# EAGLE design single_board_controller (EAGLE 9.3.0)
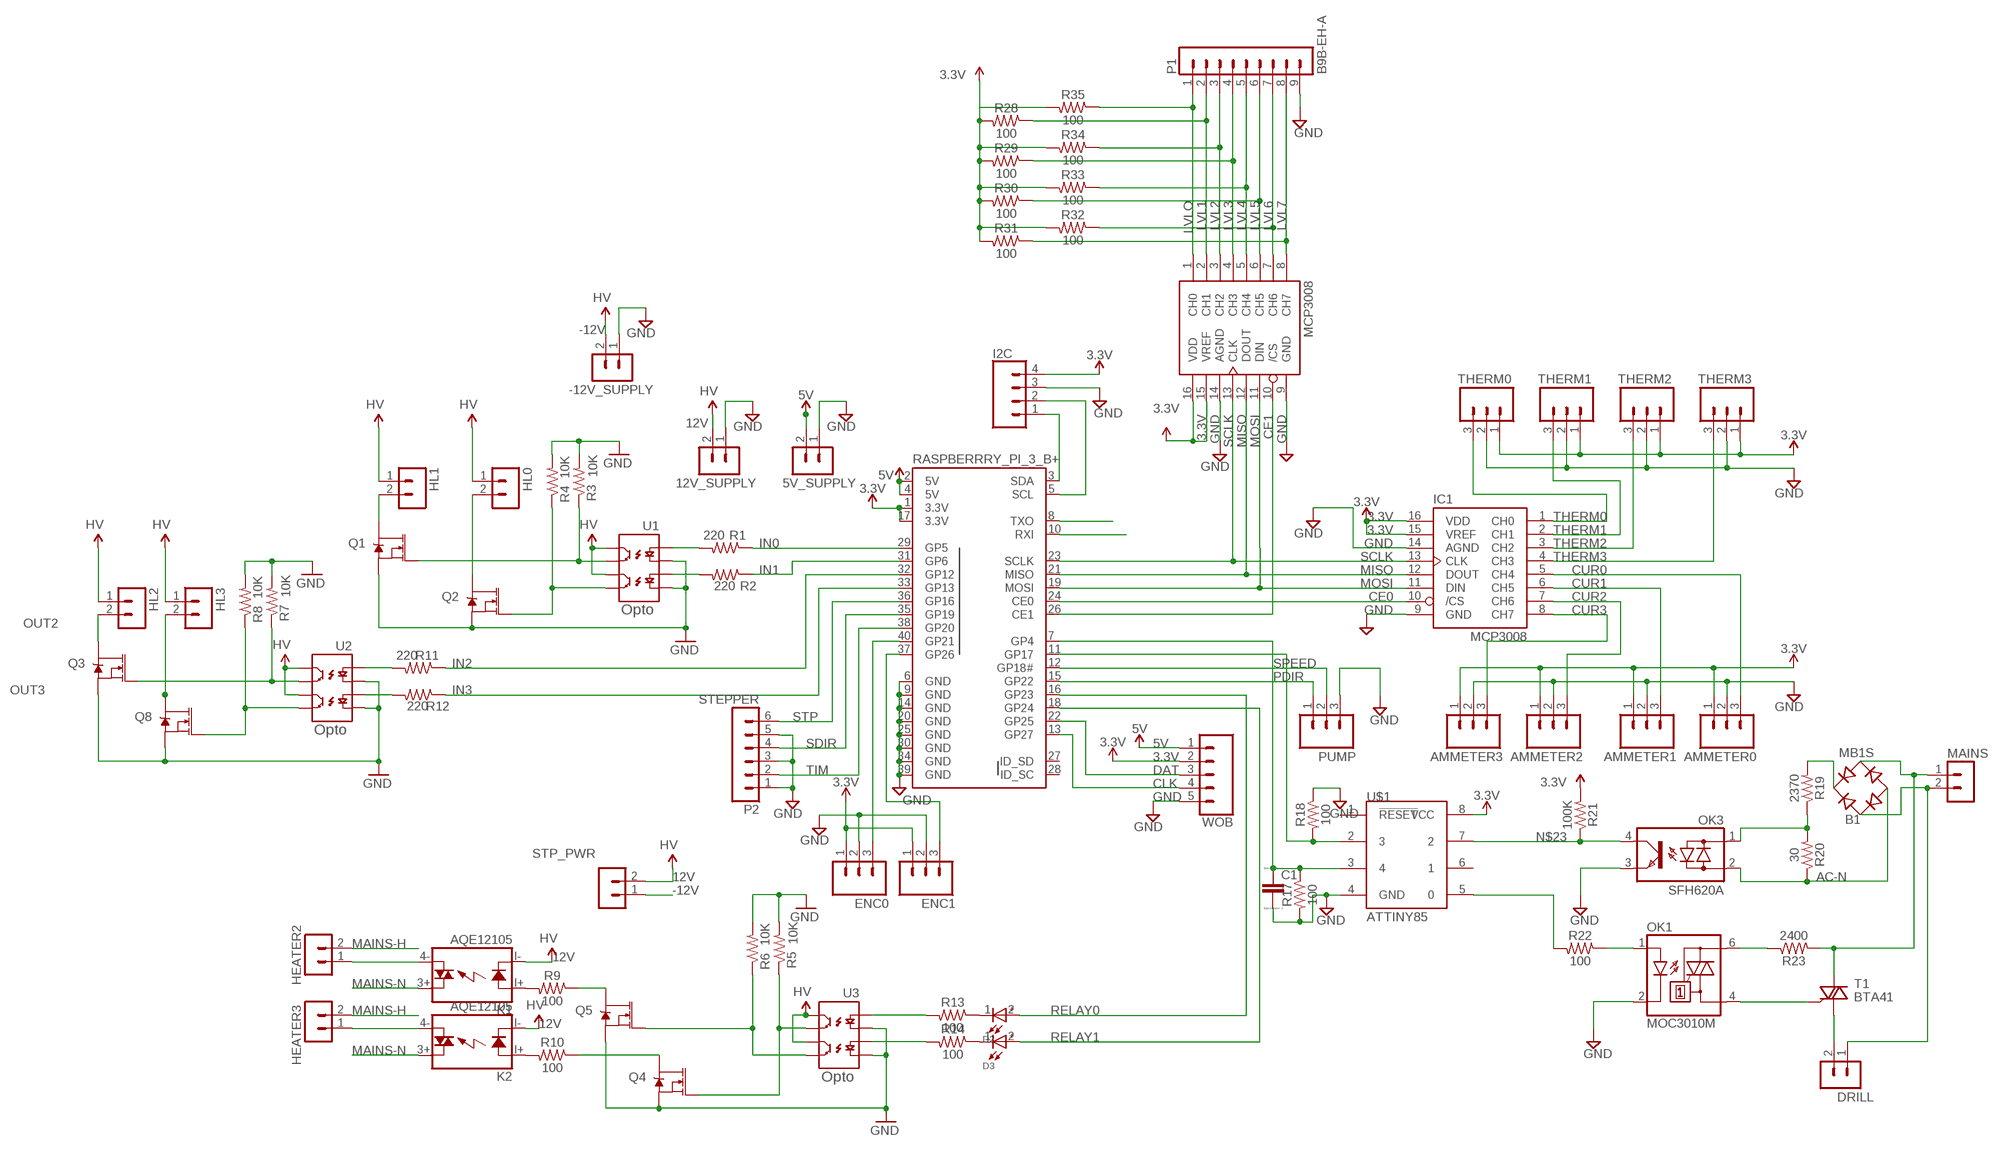
[diagram p0: schematic, sheet 1]

## Parts
5V_SUPPLY  B2P-VH  [B2P-VH]
12V_SUPPLY  B2P-VH  [B2P-VH]
-12V_SUPPLY  B2P-VH  [B2P-VH]
AMMETER0  CONN_03JST-PTH-VERT  [JST-3-PTH-VERT]
AMMETER1  CONN_03JST-PTH-VERT  [JST-3-PTH-VERT]
AMMETER2  CONN_03JST-PTH-VERT  [JST-3-PTH-VERT]
AMMETER3  CONN_03JST-PTH-VERT  [JST-3-PTH-VERT]
B1  MB1S  [SOIC-4]
C1  C  [C0805]
D2  WL-SMRW_1206_156120YS75000-Y  [WL-SMRW-1206-RECT]
D3  WL-SMRW_1206_156120YS75000-Y  [WL-SMRW-1206-RECT]
DRILL  B2P-VH  [B2P-VH]
ENC0  CONN_03JST-PTH-VERT  [JST-3-PTH-VERT]
ENC1  CONN_03JST-PTH-VERT  [JST-3-PTH-VERT]
HEATER2  B2P-VH  [B2P-VH]
HEATER3  B2P-VH  [B2P-VH]
HL0  B2P-VH  [B2P-VH]
HL1  B2P-VH  [B2P-VH]
HL2  B2P-VH  [B2P-VH]
HL3  B2P-VH  [B2P-VH]
I2C  CONN_04JST-PTH-VERT  [JST-4-PTH-VERT]
IC1  MCP3008  [DIL16]
IC2  MCP3008  [DIL16]
K1  AQE12105  [AQE]
K2  AQE12105  [AQE]
MAINS  B2P-VH  [B2P-VH]
OK1  MOC3010M  [DIL06]
OK3  SFH620A  [DIL04]
P1  B9B-EH-A  [B9B-EH-A]
P2  STEPPER  B6B-EH-A  [B6B-EH-A]
PUMP  CONN_03JST-PTH-VERT  [JST-3-PTH-VERT]
Q1  35A/25V/8.5mΩ  MOSFET-NCH-FDD8780  [DPAK]
Q2  35A/25V/8.5mΩ  MOSFET-NCH-FDD8780  [DPAK]
Q3  35A/25V/8.5mΩ  MOSFET-NCH-FDD8780  [DPAK]
Q4  35A/25V/8.5mΩ  MOSFET-NCH-FDD8780  [DPAK]
Q5  35A/25V/8.5mΩ  MOSFET-NCH-FDD8780  [DPAK]
Q8  35A/25V/8.5mΩ  MOSFET-NCH-FDD8780  [DPAK]
R1  220  220OHM-1/10W-1%(0603)  [0603-RES]
R2  220  220OHM-1/10W-1%(0603)  [0603-RES]
R3  10K  10KOHM1/10W1%(0603)0603  [0603-RES]
R4  10K  10KOHM1/10W1%(0603)0603  [0603-RES]
R5  10K  10KOHM1/10W1%(0603)0603  [0603-RES]
R6  10K  10KOHM1/10W1%(0603)0603  [0603-RES]
R7  10K  10KOHM1/10W1%(0603)0603  [0603-RES]
R8  10K  10KOHM1/10W1%(0603)0603  [0603-RES]
R9  100  0.3OHM-0805-1/8W-1%  [0805]
R10  100  0.3OHM-0805-1/8W-1%  [0805]
R11  220  220OHM-1/10W-1%(0603)  [0603-RES]
R12  220  220OHM-1/10W-1%(0603)  [0603-RES]
R13  100  0.3OHM-0805-1/8W-1%  [0805]
R14  100  0.3OHM-0805-1/8W-1%  [0805]
R17  100  0.3OHM-0805-1/8W-1%  [0805]
R18  100  0.3OHM-0805-1/8W-1%  [0805]
R19  2370  0.3OHM-0805-1/8W-1%  [0805]
R20  30  0.3OHM-0805-1/8W-1%  [0805]
R21  100K  0.3OHM-0805-1/8W-1%  [0805]
R22  100  0.3OHM-0805-1/8W-1%  [0805]
R23  2400  0.3OHM-0805-1/8W-1%  [0805]
R28  100  0.3OHM-0805-1/8W-1%  [0805]
R29  100  0.3OHM-0805-1/8W-1%  [0805]
R30  100  0.3OHM-0805-1/8W-1%  [0805]
R31  100  0.3OHM-0805-1/8W-1%  [0805]
R32  100  0.3OHM-0805-1/8W-1%  [0805]
R33  100  0.3OHM-0805-1/8W-1%  [0805]
R34  100  0.3OHM-0805-1/8W-1%  [0805]
R35  100  0.3OHM-0805-1/8W-1%  [0805]
RASPBERRRY_PI_3_B+  RASPBERRYPI-40-PIN-GPIO_PTH_NO_SHROUD  [2X20]
STP_PWR  B2P-VH  [B2P-VH]
T1  BTA41  BTA26-V  [TOP3S-1]
THERM0  CONN_03JST-PTH-VERT  [JST-3-PTH-VERT]
THERM1  CONN_03JST-PTH-VERT  [JST-3-PTH-VERT]
THERM2  CONN_03JST-PTH-VERT  [JST-3-PTH-VERT]
THERM3  CONN_03JST-PTH-VERT  [JST-3-PTH-VERT]
U1  OPTOISOLATOR-2SOIC8  [SO08-2]
U2  OPTOISOLATOR-2SOIC8  [SO08-2]
U3  OPTOISOLATOR-2SOIC8  [SO08-2]
U$1  ATTINY85  [8P3]
WOB  CONN_05JST-VERT  [JST-5-PTH-VERT]

## Nets
3.3V: AMMETER0.1 AMMETER1.1 AMMETER2.1 AMMETER3.1 ENC0.1 ENC1.1 I2C.4 IC1.15(VREF) IC1.16(VDD) IC2.15(VREF) IC2.16(VDD) R21.2 R28.2 R29.2 R30.2 R31.2 R32.2 R33.2 R34.2 R35.2 RASPBERRRY_PI_3_B+.1(3.3V) RASPBERRRY_PI_3_B+.17(3.3V) THERM0.1 THERM1.1 THERM2.1 THERM3.1 U$1.8(VCC) WOB.2
5V: 5V_SUPPLY.2 RASPBERRRY_PI_3_B+.2(5V) RASPBERRRY_PI_3_B+.4(5V) WOB.1
12V: 12V_SUPPLY.2 HL0.1 HL1.1 HL2.1 HL3.1 K1.I-(K) K2.I-(K) STP_PWR.2 U1.6(CL2) U1.8(CL1) U2.6(CL2) U2.8(CL1) U3.6(CL2) U3.8(CL1) ; supply symbol labelled HV
-12V: -12V_SUPPLY.2 STP_PWR.1 ; supply symbol labelled HV
AC-N: B1.- OK3.2(AC2) R20.1
CE0: IC1.10(/CS) RASPBERRRY_PI_3_B+.24(CE0)
CE1: IC2.10(/CS) RASPBERRRY_PI_3_B+.26(CE1)
CLK: RASPBERRRY_PI_3_B+.13(GP27) WOB.4
CONTROL: R18.2 RASPBERRRY_PI_3_B+.11(GP17) U$1.2
CUR0: AMMETER0.3 IC1.5(CH4)
CUR1: AMMETER1.3 IC1.6(CH5)
CUR2: AMMETER2.3 IC1.7(CH6)
CUR3: AMMETER3.3 IC1.8(CH7)
DAT: RASPBERRRY_PI_3_B+.22(GP25) WOB.3
GND: 5V_SUPPLY.1 12V_SUPPLY.1 -12V_SUPPLY.1 AMMETER0.2 AMMETER1.2 AMMETER2.2 AMMETER3.2 C1.2 ENC0.2 ENC1.2 I2C.3 IC1.9(GND) IC1.14(AGND) IC2.9(GND) IC2.14(AGND) OK1.2(C) OK3.3(E) P1.9 P2.1 P2.3 P2.5 PUMP.3 Q1.3(S) Q2.3(S) Q3.3(S) Q4.3(S) Q5.3(S) Q8.3(S) R3.2 R4.2 R5.2 R6.2 R7.2 R8.2 R17.2 R18.1 RASPBERRRY_PI_3_B+.6(GND) RASPBERRRY_PI_3_B+.9(GND) RASPBERRRY_PI_3_B+.14(GND) RASPBERRRY_PI_3_B+.20(GND) RASPBERRRY_PI_3_B+.25(GND) RASPBERRRY_PI_3_B+.30(GND) RASPBERRRY_PI_3_B+.34(GND) RASPBERRRY_PI_3_B+.39(GND) THERM0.2 THERM1.2 THERM2.2 THERM3.2 U1.2(C1) U1.4(C2) U2.2(C1) U2.4(C2) U3.2(C1) U3.4(C2) U$1.4(GND) WOB.5
IN0: R1.1 RASPBERRRY_PI_3_B+.29(GP5)
IN1: R2.1 RASPBERRRY_PI_3_B+.31(GP6)
IN2: R11.1 RASPBERRRY_PI_3_B+.32(GP12)
IN3: R12.1 RASPBERRRY_PI_3_B+.33(GP13)
LVL1: IC2.2(CH1) P1.2 R28.1
LVL2: IC2.3(CH2) P1.3 R34.1
LVL3: IC2.4(CH3) P1.4 R29.1
LVL4: IC2.5(CH4) P1.5 R33.1
LVL5: IC2.6(CH5) P1.6 R30.1
LVL6: IC2.7(CH6) P1.7 R32.1
LVL7: IC2.8(CH7) P1.8 R31.1
LVLO: IC2.1(CH0) P1.1 R35.1
MAINS-H: B1.~2(AC2) HEATER2.2 HEATER3.2 MAINS.1 R23.2 T1.A2
MAINS-N: B1.~1(AC1) DRILL.1 K1.3+(DS1) K2.3+(DS1) MAINS.2
MISO: IC1.12(DOUT) IC2.12(DOUT) RASPBERRRY_PI_3_B+.21(MISO)
MOSI: IC1.11(DIN) IC2.11(DIN) RASPBERRRY_PI_3_B+.19(MOSI)
N$1: R1.2 U1.1(A1)
N$2: R2.2 U1.3(A2)
N$3: R11.2 U2.1(A1)
N$4: R12.2 U2.3(A2)
N$5: ENC1.3 RASPBERRRY_PI_3_B+.37(GP26)
N$6: ENC0.3 RASPBERRRY_PI_3_B+.40(GP21)
N$7: OK3.1(AC1) R19.1 R20.2
N$8: OK1.1(A) R22.1
N$9: OK1.6(A2) R23.1
N$10: OK1.4(A1) T1.G
N$11: DRILL.2 T1.A1
N$12: HEATER2.1 K1.4-(DS2)
N$13: D2.1(-) R13.1
N$14: K2.I+(A) R10.2
N$15: D3.1(-) R14.1
N$16: K1.I+(A) R9.2
N$17: HEATER3.1 K2.4-(DS2)
N$22: R13.2 U3.1(A1)
N$23: OK3.4(C) R21.1 U$1.7
N$26: B1.+ R19.2
N$27: R22.2 U$1.5
N$28: I2C.2 RASPBERRRY_PI_3_B+.5(SCL)
N$29: C1.1 R17.1 RASPBERRRY_PI_3_B+.7(GP4) U$1.3
N$30: I2C.1 RASPBERRRY_PI_3_B+.3(SDA)
N$31: RASPBERRRY_PI_3_B+.10(RXI)
N$32: RASPBERRRY_PI_3_B+.8(TXO)
N$33: R14.2 U3.3(A2)
N$36: Q5.4(D) R9.1
N$37: Q4.4(D) R10.1
OUT0: HL1.2 Q1.4(D)
OUT1: HL0.2 Q2.4(D)
OUT1N: Q1.1(G) R3.1 U1.7(EM1)
OUT1N1: Q3.1(G) R7.1 U2.7(EM1)
OUT1N2: Q4.1(G) R5.1 U3.7(EM1)
OUT2: HL2.2 Q3.4(D)
OUT2N: Q2.1(G) R4.1 U1.5(EM2)
OUT2N1: Q8.1(G) R8.1 U2.5(EM2)
OUT2N2: Q5.1(G) R6.1 U3.5(EM2)
OUT3: HL3.2 Q8.4(D)
PDIR: PUMP.1 RASPBERRRY_PI_3_B+.15(GP22)
RELAY0: D2.2(+) RASPBERRRY_PI_3_B+.16(GP23)
RELAY1: D3.2(+) RASPBERRRY_PI_3_B+.18(GP24)
SCLK: IC1.13(CLK) IC2.13(CLK) RASPBERRRY_PI_3_B+.23(SCLK)
SDIR: P2.4 RASPBERRRY_PI_3_B+.35(GP19)
SPEED: PUMP.2 RASPBERRRY_PI_3_B+.12(GP18#)
STP: P2.6 RASPBERRRY_PI_3_B+.36(GP16)
THERM0: IC1.1(CH0) THERM0.3
THERM1: IC1.2(CH1) THERM1.3
THERM2: IC1.3(CH2) THERM2.3
THERM3: IC1.4(CH3) THERM3.3
TIM: P2.2 RASPBERRRY_PI_3_B+.38(GP20)
Unconnected: RASPBERRRY_PI_3_B+.27(ID_SD) RASPBERRRY_PI_3_B+.28(ID_SC) U$1.1(!RESET) U$1.6

## Notes on the sheet
- Opto
- Opto
- Opto

## Library data of the parts
5V_SUPPLY 12V_SUPPLY -12V_SUPPLY DRILL HEATER2 HEATER3 HL0 HL1-HL3 MAINS STP_PWR = con-jst-vh:B2P-VH: HEADER
AMMETER0 AMMETER1-AMMETER3 ENC0 ENC1 PUMP THERM0 THERM1-THERM3 = SparkFun-Connectors:CONN_03: Multi connection point. Often used as Generic Header-pin footprint for 0.1 inch spaced/style header connections On any of the 0.1 inch spaced packages, you can populate with these: Break Away Headers - Straight <https://www.sparkfun.com/products/116> (PRT-00116) Break Away Male Headers - Right Angle <https://www.sparkfun.com/products/553> (PRT-00553) Female Headers <https://www.sparkfun.com/products/115> (PRT-00115) Break Away Headers - Machine Pin <https://www.sparkfun.com/products/117> (PRT-00117) Break Away Female Headers - Swiss Machine Pin <https://www.sparkfun.com/products/743> (PRT-00743) Stackable Header - 3 Pin (Female, 0.1") <https://www.sparkfun.com/products/13875> (PRT-13875) For SCREWTERMINALS and SPRING TERMINALS visit here: Screw Terimnals on SparkFun.com <https://www.sparkfun.com/search/results?term=Screw+Terminals> (5mm/3.5mm/2.54mm spacing) This device is also useful as a general connection point to wire up your design to another part of your project. Our various solder wires solder well into these plated through hole pads. Hook-Up Wire - Assortment (Stranded, 22 AWG) <https://www.sparkfun.com/products/11375> (PRT-11375) Hook-Up Wire - Assortment (Solid Core, 22 AWG) <https://www.sparkfun.com/products/11367> (PRT-11367) View the entire wire category on our website here <https://www.sparkfun.com/categories/141> Special notes: Molex polarized connector foot print use with SKU : PRT-08232 with associated crimp pins and housings.; PROD_ID: CONN-13230
B1 = rectifier:MB*S: Bridge Rectifier Source: http://www.fairchildsemi.com/ds/MB/MB6S.pdf
C1 = eagle-ltspice:C: CAPACITOR, European symbol; SPICEMODEL: NONE; SPICEPREFIX: C
D2 D3 = Wurth_Elektronik_Optoelectronics_rev18a:WL-SMRW_1206: WL-SMRW SMD Mono-color Reverse mount Waterclear Characteristics Ideal for narrow space applications Narrow viewing angle Low power consumption Industry standard footprint Small package for exceptional brightness To emit light through a small cut-out hole in PCB Compatible with automatic placement machine Applications Front panels indicators LCD backlighting Backlighting for keypad, symbol and switch button Messaenger board Networking and telecommunications Mobile devices Instrumentation Fitness wearables Audio and video Medical and healthcare <http://katalog.we-online.de/media/images/v2/Family_WL-SMRW_neu.jpg> Details see: http://katalog.we-online.de/en/led/WL-SMRW?m <http://katalog.we-online.de/media/images/v2/Family_WL-SMRW_neu.jpg> Details see: http://katalog.we-online.de/en/led/WL-SMRW?m Updated 2015-04-10 2015 (C) Wurth Elektronik
I2C = SparkFun-Connectors:CONN_04: Multi connection point. Often used as Generic Header-pin footprint for 0.1 inch spaced/style header connections On any of the 0.1 inch spaced packages, you can populate with these: Break Away Headers - Straight <https://www.sparkfun.com/products/116> (PRT-00116) Break Away Male Headers - Right Angle <https://www.sparkfun.com/products/553> (PRT-00553) Female Headers <https://www.sparkfun.com/products/115> (PRT-00115) Break Away Headers - Machine Pin <https://www.sparkfun.com/products/117> (PRT-00117) Break Away Female Headers - Swiss Machine Pin <https://www.sparkfun.com/products/743> (PRT-00743) For SCREWTERMINALS and SPRING TERMINALS visit here: Screw Terimnals on SparkFun.com <https://www.sparkfun.com/search/results?term=Screw+Terminals> (5mm/3.5mm/2.54mm spacing) This device is also useful as a general connection point to wire up your design to another part of your project. Our various solder wires solder well into these plated through hole pads. Hook-Up Wire - Assortment (Stranded, 22 AWG) <https://www.sparkfun.com/products/11375> (PRT-11375) Hook-Up Wire - Assortment (Solid Core, 22 AWG) <https://www.sparkfun.com/products/11367> (PRT-11367) View the entire wire category on our website here <https://www.sparkfun.com/categories/141> Special notes: Molex polarized connector foot print use with SKU : PRT-08231 with associated crimp pins and housings. 1MM SMD Version SKU: PRT-10208; PROD_ID: CONN-13251
IC1 IC2 = adafruit:MCP3008
K1 K2 = G6DN_relay:AQE*: SOLID STATE RELAY NAiS source: http://www.mew-europe.com/.. en_ds_61610_0000.pdf
OK1 = optocoupler:MOC30*M: RANDOM-PHASE OPTOISOLATORS TRIAC DRIVER OUTPUT Source: http://www.fairchildsemi.com MOC3020-M.pdf; MF: FAIRCHILD SEMICONDUCTOR; MPN: MOC3010-M; OC_FARNELL: 1505423; OC_NEWARK: 72K8892
OK3 = optocoupler:SFH620: Optocoupler, Phototransistor Output, AC Input Source: http://www.vishay.com/docs/83675/sfh620.pdf; MPN: SFH620A-2; OC_FARNELL: 1469594; OC_NEWARK: 97K9546
P1 = con-jst-eh:B9B-EH-A: HEADER
P2 = con-jst-eh:B6B-EH-A: HEADER
Q1-Q5 Q8 = SparkFun-DiscreteSemi:MOSFET-NCH: N-channel MOSFETs Voltage controlled devices that allow control of high current outputs. SparkFun Products: SparkFun OpenScale <https://www.sparkfun.com/products/13261> SparkFun Digital Sandbox <https://www.sparkfun.com/products/12651> SparkFun Monster Moto Shield <https://www.sparkfun.com/products/10182> SparkFun MOSFET Power Controller <https://www.sparkfun.com/products/11214>; PROD_ID: TRANS-09984
R1 R2 R11 R12 = SparkFun-Resistors:220OHM-1/10W-1%(0603): RES-07861; PROD_ID: RES-07861
R3-R8 = SparkFun-Resistors:10KOHM1/10W1%(0603): RES-00824; PROD_ID: RES-00824
R9 R10 R13 R14 R17-R23 R28-R35 = SparkFun-Resistors:0.3OHM: 0.3Ω resistor A resistor is a passive two-terminal electrical component that implements electrical resistance as a circuit element. Resistors act to reduce current flow, and, at the same time, act to lower voltage levels within circuits. - Wikipedia; PROD_ID: RES-11622; VALUE: 0.3
RASPBERRRY_PI_3_B+ = SparkFun-Connectors:RASPBERRYPI-40-PIN-GPIO: Raspberry Pi GPIO Header 2x20 pin connector, as found on B, B+, A+ models. Both shrouded PTH and SMT versions available. SparkFun Products: GPIO Shrouded Header <https://www.sparkfun.com/products/13054>- PTH SparkFun Pi Wedge (Preassembled) <https://www.sparkfun.com/products/13717>
T1 = triac:BTA26: 25A TRIAC Source: http://www.st.com/stonline/products/literature/ds/7470.pdf
U1-U3 = SparkFun-DiscreteSemi:OPTOISOLATOR-2: Description: Dual gate opto isolator. Vishay part : ILD213T; PROD_ID: IC-09076
U$1 = attiny85:ATTINY85
WOB = SparkFun-Connectors:CONN_05: Multi connection point. Often used as Generic Header-pin footprint for 0.1 inch spaced/style header connections On any of the 0.1 inch spaced packages, you can populate with these: Break Away Headers - Straight <https://www.sparkfun.com/products/116> (PRT-00116) Break Away Male Headers - Right Angle <https://www.sparkfun.com/products/553> (PRT-00553) Female Headers <https://www.sparkfun.com/products/115> (PRT-00115) Break Away Headers - Machine Pin <https://www.sparkfun.com/products/117> (PRT-00117) Break Away Female Headers - Swiss Machine Pin <https://www.sparkfun.com/products/743> (PRT-00743) For SCREWTERMINALS and SPRING TERMINALS visit here: Screw Terimnals on SparkFun.com <https://www.sparkfun.com/search/results?term=Screw+Terminals> (5mm/3.5mm/2.54mm spacing) This device is also useful as a general connection point to wire up your design to another part of your project. Our various solder wires solder well into these plated through hole pads. Hook-Up Wire - Assortment (Stranded, 22 AWG) <https://www.sparkfun.com/products/11375> (PRT-11375) Hook-Up Wire - Assortment (Solid Core, 22 AWG) <https://www.sparkfun.com/products/11367> (PRT-11367) View the entire wire category on our website here <https://www.sparkfun.com/categories/141> Special notes: Molex polarized connector foot print use with SKU : PRT-08231 with associated crimp pins and housings. 1MM SMD Version SKU: PRT-10208

## Board
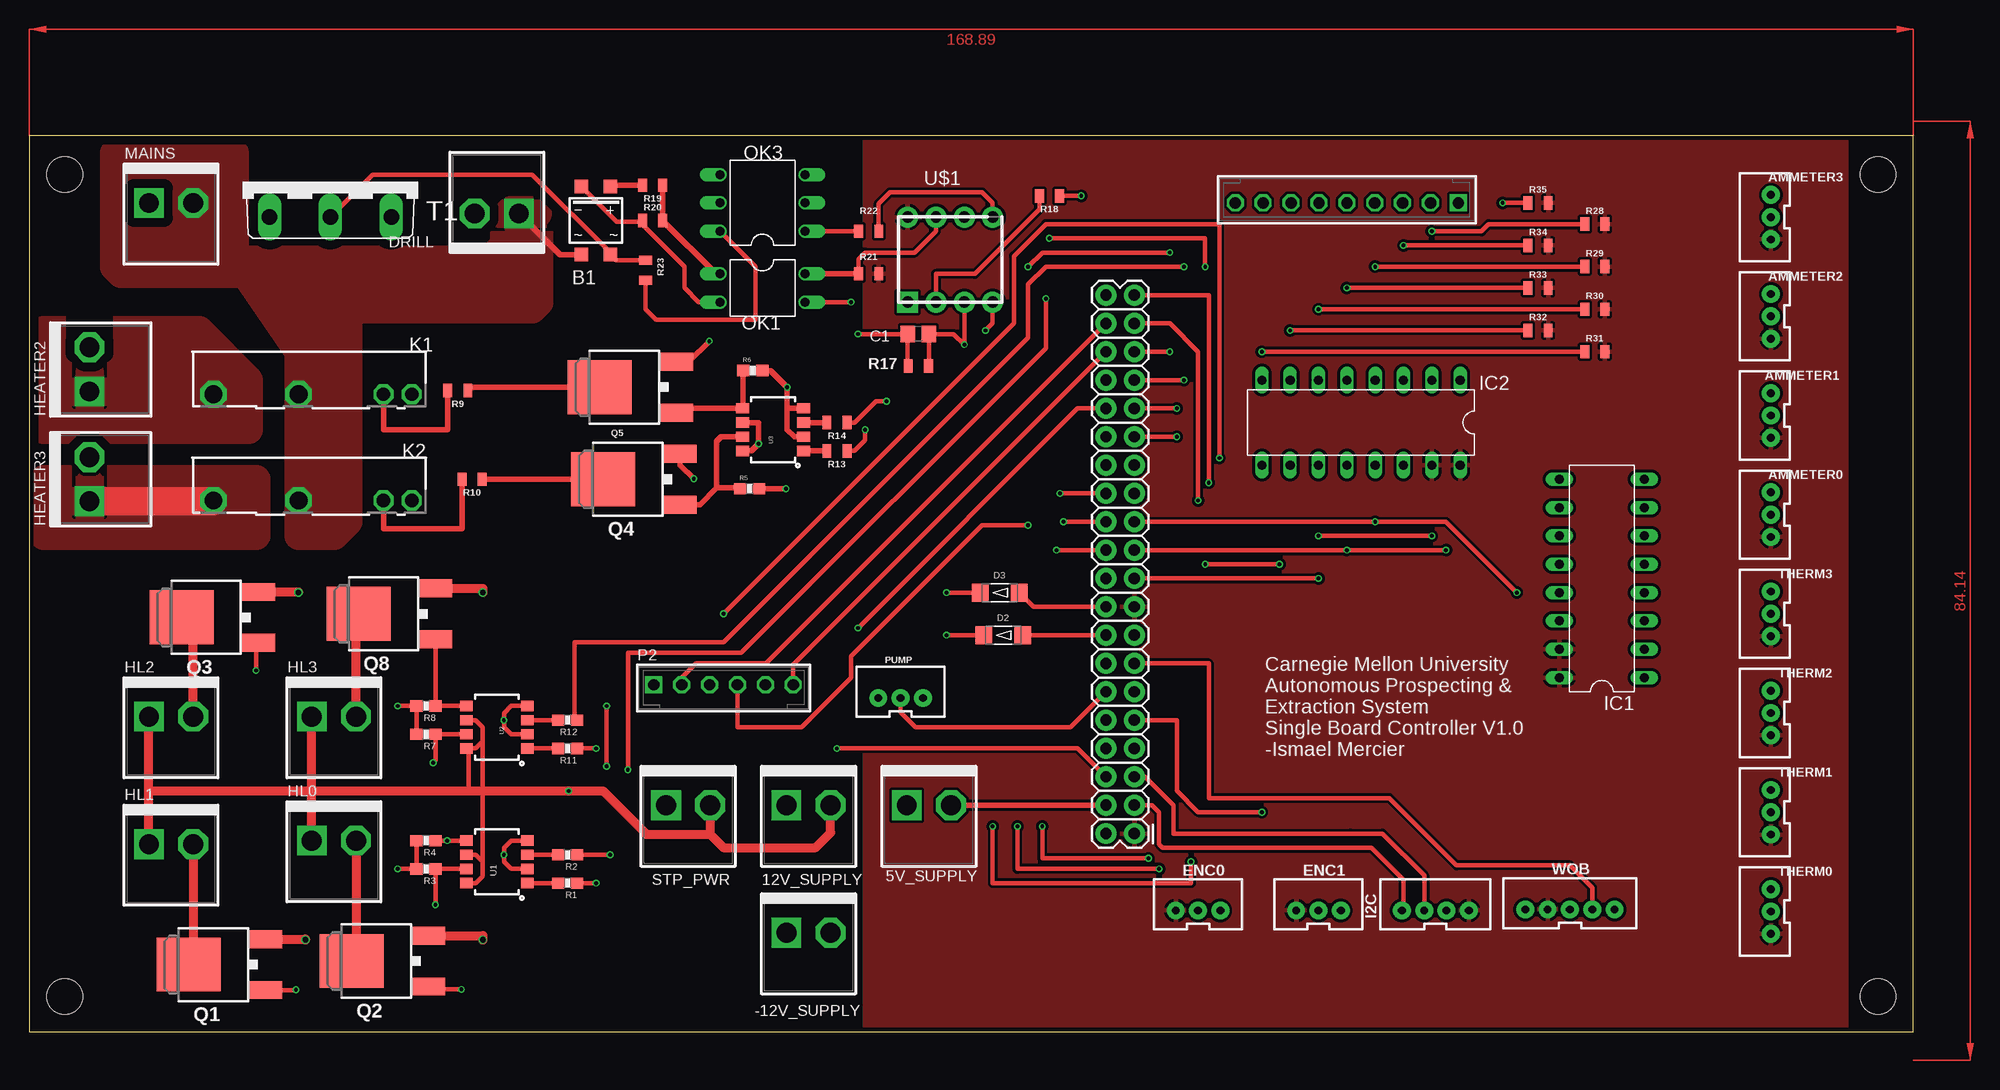
[diagram p1: board, top side]
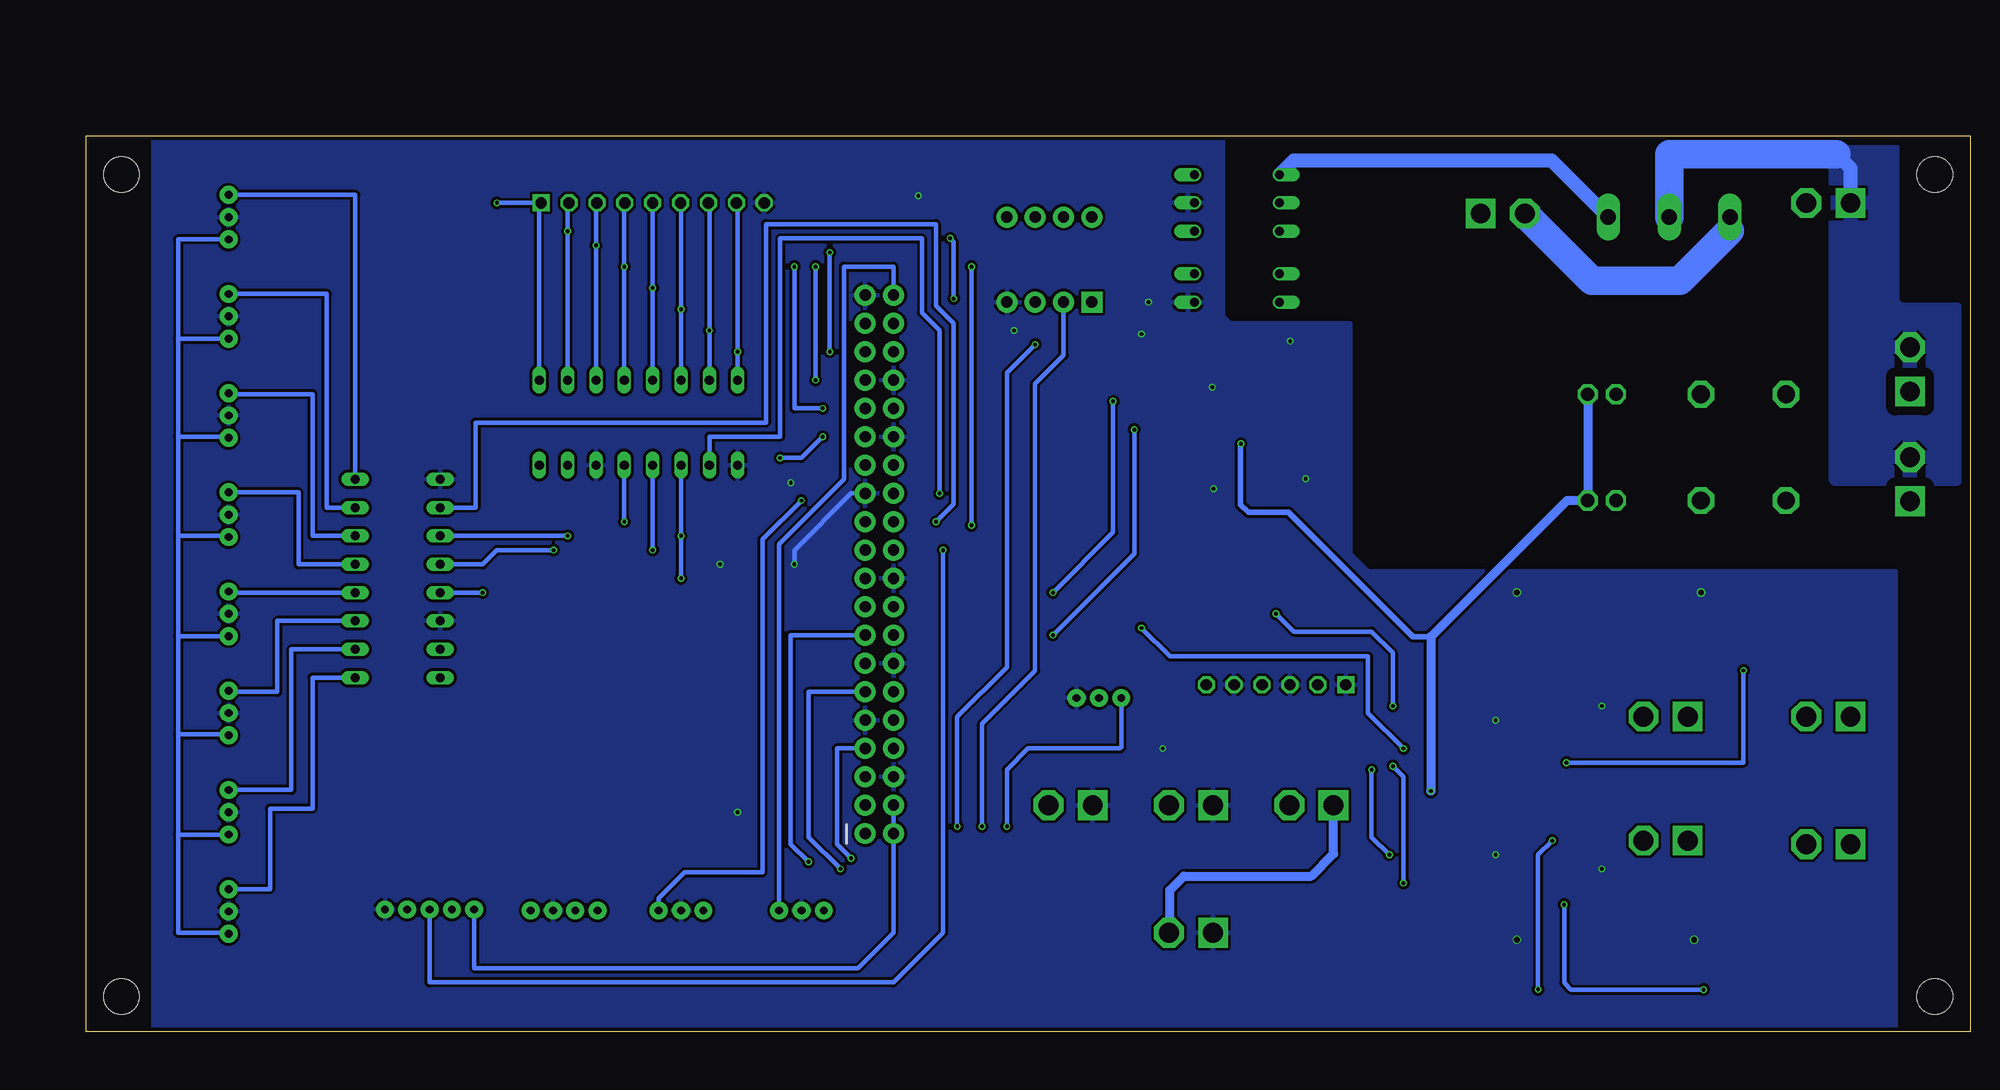
[diagram p2: board, bottom side, seen from below]

Size 168.89 x 80.31 mm. Coordinates in mm from the lower left corner, seen from the top.
Outline: 0,0 168.89,0 168.89,80.31 0,80.31 0,0
Copper layers (1*16): Top 0.035559375mm / dielectric 1.6mm / Bottom 0.035559375mm
Design rules "oshpark-2layer": minimum track width 6mil, minimum drill 10mil, track to track 6mil, track to pad 6mil, pad to pad 6mil, via to via 6mil, smd to smd 6mil, copper to edge 15mil, drill to drill 6mil, minimum pad ring 5mil, minimum via ring 5mil, stop-mask expansion 2.5mil, vias tented up to drill 0mil, thermal gap 10mil
Holes 3.17 mm at 165.74,76.83 165.74,3.18 3.17,76.83 3.17,3.18

### Footprints (pad centres in the part's own frame; a part is rotated, then mirrored left to right if it is on the bottom)
B2P-VH = drill 1.778 square: 1 -1.98,0 | drill 1.778 octagon: 2 1.98,0
JST-3-PTH-VERT = drill 0.7 pad 1.6: 1 -2,-0.55; 2 0,-0.55; 3 2,-0.55
SOIC-4 = smd 1.2 x 1.2: + 1.3,3.05; - -1.3,3.05; ~1 -1.3,-3.05; ~2 1.3,-3.05
C0805 = smd 1.3 x 1.5: 1 -0.95,0; 2 0.95,0
WL-SMRW-1206-RECT = smd 1.5 x 1.6: 1 -1.75,0; 2 1.75,0
JST-4-PTH-VERT = drill 0.7 pad 1.6: 1 -3,-0.55; 2 -1,-0.55; 3 1,-0.55; 4 3,-0.55
DIL16 = drill 0.813 long: 1 -8.89,-3.81; 2 -6.35,-3.81; 3 -3.81,-3.81; 4 -1.27,-3.81; 5 1.27,-3.81; 6 3.81,-3.81; 7 6.35,-3.81; 8 8.89,-3.81; 9 8.89,3.81; 10 6.35,3.81; 11 3.81,3.81; 12 1.27,3.81; 13 -1.27,3.81; 14 -3.81,3.81; 15 -6.35,3.81; 16 -8.89,3.81
AQE = drill 1.6 octagon: 3+ -7.62,0; 4- 0,0 | drill 1.2 octagon: I+ -15.24,0; I- -17.78,0
DIL06 = drill 0.813 offset: 1 -2.54,-3.81; 2 0,-3.81; 3 2.54,-3.81; 4 2.54,3.81; 5 0,3.81; 6 -2.54,3.81
DIL04 = drill 0.813 offset: 1 -1.27,-3.81; 2 1.27,-3.81; 3 1.27,3.81; 4 -1.27,3.81
B9B-EH-A = drill 1.016 square: 1 -10,0 | drill 1.016 octagon: 2 -7.5,0; 3 -5,0; 4 -2.5,0; 5 0,0; 6 2.5,0; 7 5,0; 8 7.5,0; 9 10,0
B6B-EH-A = drill 1.016 square: 1 -6.25,0 | drill 1.016 octagon: 2 -3.75,0; 3 -1.25,0; 4 1.25,0; 5 3.75,0; 6 6.25,0
DPAK = smd 1.6 x 3: 1 -2.28,-5.31; 3 2.28,-5.31 | smd 4.826 x 5.715: 4 0,1.588
0603-RES = smd 1.1 x 1: 1 -0.85,0; 2 0.85,0
0805 = smd 0.8 x 1.2: 1 -0.9,0; 2 0.9,0
2X20 = drill 1.016 pad 1.88: 1 0,0; 2 0,2.54; 3 2.54,0; 4 2.54,2.54; 5 5.08,0; 6 5.08,2.54; 7 7.62,0; 8 7.62,2.54; 9 10.16,0; 10 10.16,2.54; 11 12.7,0; 12 12.7,2.54; 13 15.24,0; 14 15.24,2.54; 15 17.78,0; 16 17.78,2.54; 17 20.32,0; 18 20.32,2.54; 19 22.86,0; 20 22.86,2.54; 21 25.4,0; 22 25.4,2.54; 23 27.94,0; 24 27.94,2.54; 25 30.48,0; 26 30.48,2.54; 27 33.02,0; 28 33.02,2.54; 29 35.56,0; 30 35.56,2.54; 31 38.1,0; 32 38.1,2.54; 33 40.64,0; 34 40.64,2.54; 35 43.18,0; 36 43.18,2.54; 37 45.72,0; 38 45.72,2.54; 39 48.26,0; 40 48.26,2.54
TOP3S-1 = drill 1.397 long: A1 -5.461,-3.175; A2 0,-3.175; G 5.461,-3.175
SO08-2 = smd 0.914 x 1.143: 1 -1.905,-2.731; 2 -0.635,-2.731; 3 0.635,-2.731; 4 1.905,-2.731; 5 1.905,2.731; 6 0.635,2.731; 7 -0.635,2.731; 8 -1.905,2.731
8P3 = drill 1.016 pad 1.88 square: 1 -3.81,3.81 | drill 1.016 pad 1.88: 2 -3.81,1.27; 3 -3.81,-1.27; 4 -3.81,-3.81; 5 3.81,-3.81; 6 3.81,-1.27; 7 3.81,1.27; 8 3.81,3.81
JST-5-PTH-VERT = drill 0.7 pad 1.6: 1 -4,0.18; 2 -2,0.18; 3 0,0.18; 4 2,0.18; 5 4,0.18

### Placement (x,y rotation side)
5V_SUPPLY  80.64,20.32 0 top
12V_SUPPLY  69.85,20.32 0 top
-12V_SUPPLY  69.85,8.89 0 top
AMMETER0  155.58,46.36 90 top
AMMETER1  155.58,55.25 90 top
AMMETER2  155.58,64.13 90 top
AMMETER3  155.58,73.02 90 top
B1  50.8,72.71 0 top
C1  79.69,62.55 180 top
D2  87.31,35.56 0 top
D3  86.99,39.37 0 top
DRILL  41.91,73.34 180 top
ENC0  104.77,11.43 0 top
ENC1  115.57,11.43 0 top
HEATER2  5.4,59.37 90 top
HEATER3  5.4,49.53 90 top
HL0  27.3,17.14 0 top
HL1  12.7,16.83 0 top
HL2  12.7,28.26 0 top
HL3  27.3,28.26 0 top
I2C  126.05,11.43 0 top
IC1  140.97,40.64 90 top
IC2  119.38,54.61 180 top
K1  16.51,57.15 180 top
K2  16.51,47.62 180 top
MAINS  12.7,74.3 0 top
OK1  65.72,74.3 90 top
OK3  65.72,66.67 270 top
P1  118.11,74.3 180 top
P2  62.23,31.11 0 top
PUMP  78.11,30.48 0 top
Q1  15.88,6.03 90 top
Q2  30.48,6.35 90 top
Q3  15.24,37.15 90 top
Q4  53.02,49.53 90 top
Q5  52.7,57.78 90 top
Q8  31.12,37.47 90 top
R1  48.26,13.34 180 top
R2  48.26,15.88 180 top
R3  35.56,14.61 180 top
R4  35.56,17.14 180 top
R5  64.56,48.69 0 top
R6  64.86,59.27 0 top
R7  35.56,26.67 180 top
R8  35.56,29.21 180 top
R9  38.42,57.47 180 top
R10  39.69,49.53 180 top
R11  48.26,25.4 180 top
R12  48.26,27.94 180 top
R13  72.39,52.07 180 top
R14  72.39,54.61 180 top
R17  79.69,59.69 180 top
R18  91.44,74.93 180 top
R19  55.88,75.88 180 top
R20  55.88,72.71 0 top
R21  75.25,67.94 0 top
R22  75.25,71.75 0 top
R23  55.24,68.26 90 top
R28  140.34,72.39 0 top
R29  140.34,68.58 0 top
R30  140.34,64.77 0 top
R31  140.34,60.96 0 top
R32  135.26,62.86 0 top
R33  135.26,66.67 0 top
R34  135.26,70.48 0 top
R35  135.26,74.3 0 top
RASPBERRRY_PI_3_B+  99.06,17.78 90 top
STP_PWR  59.05,20.32 0 top
T1  26.99,76.2 0 top
THERM0  155.58,10.8 90 top
THERM1  155.58,19.68 90 top
THERM2  155.58,28.57 90 top
THERM3  155.58,37.47 90 top
U1  41.91,15.24 90 top
U2  41.91,27.31 90 top
U3  66.67,53.97 90 top
U$1  82.55,69.22 90 top
WOB  138.11,10.8 0 top

### Tracks (layer width: path | path; a pad name or v marks a point on that pad's centre or on a via)
3.3V
  Bottom 0.406: AMMETER3.1 160.66,71.02 160.66,62.13 | 160.66,62.13 AMMETER2.1 | 160.66,62.13 160.66,53.34 | AMMETER1.1 156.12,53.34 160.66,53.34 | 160.66,53.34 160.66,44.45 | 160.66,44.45 156.12,44.45 AMMETER0.1 | 160.66,35.47 THERM3.1 | 160.66,44.45 160.66,35.47 | 160.66,35.47 160.66,26.67 | 160.66,26.67 156.12,26.67 THERM2.1 | 160.66,17.68 THERM1.1 | 160.66,26.67 160.66,17.68 | 160.66,17.68 160.66,8.89 156.12,8.89 THERM0.1
  pour Top (isolate 0.254): 74.93,84.45 74.93,-0.95 73.02,-2.86 162.88,-2.86 162.88,84.45
5V
  Top 0.508: 5V_SUPPLY.2 RASPBERRRY_PI_3_B+.4
  Bottom 0.406: WOB.1 134.11,5.71 99.69,5.71 96.52,8.89 RASPBERRRY_PI_3_B+.2 RASPBERRRY_PI_3_B+.4
12V  (via drill 0.35)
  Top 0.406: 39.37,21.59 39.37,25.21 U2.8 40,25.4 40.64,26.04 | U1.8 40,13.34 40.64,13.97 40.64,15.24 | 40.64,15.24 40,15.88 U1.6 | 40.64,15.24 40.64,21.59 40.64,26.04 | U2.6 40,27.94 40.64,27.31 40.64,26.04
  Top 0.508: U3.8 64.72,52.07 v65.37,52.71 65.37,54.58 65.34,54.61 U3.6
  Top 0.813: STP_PWR.2 61.03,17.71 | 61.03,17.71 62.23,16.51 70.48,16.51 71.83,17.86 12V_SUPPLY.2 | HL1.1 10.72,21.59 | 10.72,21.59 HL2.1 | HL0.1 25.32,21.59 | 25.32,21.59 HL3.1 | 10.72,21.59 25.32,21.59 | 25.32,21.59 39.37,21.59 40.64,21.59 v48.34,21.59 51.43,21.59 55.32,17.71 61.03,17.71
  Bottom 0.508: 48.35,35.42 49.97,35.42 61.12,46.57 64.71,46.57 65.41,47.27 65.41,52.68 v65.37,52.71
  Bottom 0.813: K1.I- K2.I- 36.14,47.62 48.35,35.42 48.35,21.58 48.35,21.59 v48.34,21.59
-12V
  Bottom 0.813: -12V_SUPPLY.2 71.75,8.96 71.75,12.7 70.48,13.97 59.05,13.97 57.07,15.95 STP_PWR.1
AC-N
  Top 0.406: R20.1 54.98,72.34 58.74,68.58 58.74,66.67 60.01,65.41 OK3.2 | B1.- 52.63,72.63 54.9,72.63
  Top 0.508: 54.9,72.63 R20.1
CE0  (via drill 0.35)
  Top 0.406: RASPBERRRY_PI_3_B+.24 v92.71,45.72
  Bottom 0.406: IC1.10 133.99,46.99 133.99,54.61 107.95,54.61 107.95,72.39 92.71,72.39 92.71,65.09 91.12,63.5 91.12,47.31 v92.71,45.72
CE1  (via drill 0.35)
  Top 0.406: RASPBERRRY_PI_3_B+.26 v92.39,48.26
  Bottom 0.406: IC2.10 113.03,53.34 106.68,53.34 106.68,71.12 93.98,71.12 93.98,64.45 92.39,62.86 v92.39,48.26
CLK
  Top 0.406: WOB.4 140.11,12.92 138.11,14.92 127.95,14.92 121.92,20.96 105.73,20.96 105.73,33.02 RASPBERRRY_PI_3_B+.13
CONTROL  (via drill 0.35)
  Top 0.406: v101.28,14.61 88.58,14.61 v88.58,18.42 | R18.2 90.54,73.71 84.77,67.94 81.28,67.94 U$1.2
  Bottom 0.406: RASPBERRRY_PI_3_B+.11 104.14,30.48 104.14,17.46 v101.28,14.61 | v88.58,18.42 88.58,27.62 83.82,32.39 83.82,58.1 81.28,60.64 U$1.2
CUR0
  Bottom 0.406: IC1.5 149.86,41.91 149.86,48.36 AMMETER0.3
CUR1
  Bottom 0.406: IC1.6 148.59,44.45 148.59,57.15 156.12,57.15 AMMETER1.3
CUR2
  Bottom 0.406: IC1.7 147.32,46.99 147.32,66.13 AMMETER2.3
CUR3
  Bottom 0.406: IC1.8 144.78,75.02 AMMETER3.3
DAT  (via drill 0.35)
  Top 0.406: RASPBERRRY_PI_3_B+.22 v92.08,43.18
  Bottom 0.406: v92.08,43.18 92.08,8.89 96.52,4.45 138.11,4.45 WOB.3
GND  (via drill 0.35, 0.5)
  Top 0.406: 44.45,26.67 U2.2 43.18,26.67 42.54,27.31 v42.54,27.94 42.54,28.57 43.18,29.21 U2.4 | RASPBERRRY_PI_3_B+.6 93.98,25.4 v72.39,25.4 | RASPBERRRY_PI_3_B+.39 105.73,66.04 v105.73,49.21 | OK3.3 v73.66,65.41 | R17.2 78.74,59.74 C1.2 v74.3,62.55 | U$1.4 86.36,63.5 v85.72,62.86 | v105.41,41.91 v112.08,41.91 | v94.3,74.93 R18.1 | v33.02,29.21 R8.2 R7.2 | v33.02,14.61 R3.2 R4.2 | U1.2 43.18,14.61 42.54,15.24 v42.54,15.88 42.54,16.51 43.18,17.14 U1.4 | RASPBERRRY_PI_3_B+.9 102.87,27.94 102.87,21.59 104.77,19.68 v110.49,19.68
  Top 0.508: Q5.3 59.11,60.06 v60.96,61.91 | v59.57,49.57 58.33,50.81 Q4.3 | 67.94,55.88 U3.4 | U3.2 68.58,53.34 67.94,53.97 67.94,55.88 | 67.94,55.88 v67.94,57.78 66.46,59.27 R6.2 | R5.2 v67.8,48.69 v67.82,48.67
  Top 0.813: Q3.3 24.13,39.43 v24.13,39.37 | Q8.3 40.64,39.75 v40.64,39.37 | Q1.3 24.77,8.31 v24.77,8.26 | Q2.3 40.64,8.63 v40.64,8.26
  Bottom 0.406: RASPBERRRY_PI_3_B+.25 100.33,48.26 105.41,43.18 v105.41,41.91
  pour Bottom (isolate 0.254): 162.88,-2.22 162.88,84.77 70.17,84.77 66.99,81.6 66.99,64.13 66.36,63.5 55.56,63.5 55.56,42.86 53.97,41.28 6.67,41.28 6.67,-2.22
IN0  (via drill 0.35)
  Top 0.406: RASPBERRRY_PI_3_B+.29 v102.87,53.34 | v106.68,51.44 106.68,72.39 91.12,72.39 88.27,69.53 88.27,63.5 v62.23,37.47 | v51.75,29.21 v51.75,23.81 | v50.8,13.34 R1.1
  Bottom 0.406: v102.87,53.34 104.77,51.44 v106.68,51.44 | v62.23,37.47 60.64,35.88 53.66,35.88 51.75,33.97 v51.75,29.21 | v51.75,23.81 50.8,22.86 v50.8,13.34
IN1  (via drill 0.35)
  Top 0.406: RASPBERRRY_PI_3_B+.31 v102.87,55.88 | v105.41,68.58 105.41,71.12 v91.44,71.12 | v91.12,65.72 91.12,61.28 63.82,33.97 53.66,33.97 v53.66,23.5 | v52.07,15.88 R2.1
  Bottom 0.406: v102.87,55.88 105.41,55.88 v105.41,68.58 | v91.44,71.12 91.12,70.8 v91.12,65.72 | v53.66,23.5 53.66,17.46 v52.07,15.88
IN2  (via drill 0.35)
  Top 0.406: RASPBERRRY_PI_3_B+.32 93.98,55.88 v74.3,36.2 | v50.8,25.4 R11.1
  Bottom 0.406: v74.3,36.2 71.75,33.66 53.97,33.66 53.97,28.57 v50.8,25.4
IN3  (via drill 0.35)
  Top 0.406: RASPBERRRY_PI_3_B+.33 v103.5,58.42 | v103.5,68.58 91.12,68.58 89.53,66.99 89.53,62.23 62.23,34.92 48.89,34.92 48.89,28.16 R12.1
  Bottom 0.406: v103.5,68.58 v103.5,58.42
LVL1  (via drill 0.35)
  Top 0.406: v125.73,71.75 130.18,71.75 130.81,72.39 R28.1
  Bottom 0.406: IC2.2 v125.73,71.75 125.73,74.17 P1.2
LVL2  (via drill 0.35)
  Top 0.406: R34.1 v123.19,70.48
  Bottom 0.406: IC2.3 v123.19,70.48 123.19,74.22 P1.3
LVL3  (via drill 0.35)
  Top 0.406: v120.65,68.58 R29.1
  Bottom 0.406: IC2.4 v120.65,68.58 120.65,74.25 P1.4
LVL4  (via drill 0.35)
  Top 0.406: R33.1 v118.11,66.67
  Bottom 0.406: IC2.5 v118.11,66.67 P1.5
LVL5  (via drill 0.35)
  Top 0.406: v115.57,64.77 R30.1
  Bottom 0.406: IC2.6 v115.57,64.77 115.57,74.25 P1.6
LVL6  (via drill 0.35)
  Top 0.406: R32.1 v113.03,62.86
  Bottom 0.406: IC2.7 v113.03,62.86 113.03,74.22 P1.7
LVL7  (via drill 0.35)
  Top 0.406: R31.1 v110.49,60.96
  Bottom 0.406: IC2.8 v110.49,60.96 110.49,74.17 P1.8
LVLO  (via drill 0.35)
  Top 0.406: R35.1 v132.08,74.3
  Bottom 0.406: v132.08,74.3 128.27,74.3 | 128.27,74.3 P1.1 | IC2.1 128.27,74.3
MAINS-H
  Top 0.406: T1.A2 30.8,76.83 45.08,76.83 52.1,69.82 B1.~2 52.59,69.16 R23.2
  Bottom 1.27: MAINS.1 10.72,77.39 11.99,78.66
  Bottom 2.54: T1.A2 26.99,78.66 11.99,78.66
  pour Bottom (isolate 0.813): 6.98,79.38 6.98,65.41 6.35,64.77 1.27,64.77 1.27,49.53 12.07,49.53 12.07,80.01 7.62,80.01
MAINS-N
  Top 0.508: DRILL.1 47.57,69.66 B1.~1
  pour Top (isolate 0.813): 24.13,60.96 24.13,44.45 27.3,44.45 28.57,45.72 28.57,64.77 45.08,64.77 45.72,65.41 45.72,73.02 45.08,73.66 43.18,73.66 42.54,73.02 42.54,70.48 41.27,69.22 19.05,69.22 18.41,69.85 18.41,78.74 7.62,78.74 7.62,68.58 8.25,67.94 19.34,67.94
MISO  (via drill 0.35)
  Top 0.406: RASPBERRRY_PI_3_B+.21 v118.11,43.18 v127,43.18
  Bottom 0.406: v118.11,43.18 IC2.12 | v127,43.18 132.08,43.18 133.35,41.91 IC1.12
MOSI  (via drill 0.35)
  Top 0.406: RASPBERRRY_PI_3_B+.19 v115.57,40.64 | v115.57,44.45 v125.73,44.45
  Bottom 0.406: v115.57,40.64 v115.57,44.45 IC2.11 | v125.73,44.45 IC1.11
N$1
  Top 0.406: R1.2 U1.1
N$2
  Top 0.406: R2.2 U1.3
N$3
  Top 0.406: R11.2 U2.1
N$4
  Top 0.406: R12.2 U2.3
N$5  (via drill 0.35)
  Top 0.406: RASPBERRRY_PI_3_B+.37 102.23,63.5 104.77,60.96 v104.77,47.62
  Bottom 0.406: v104.77,47.62 108.27,44.13 108.27,14.29 115.25,14.29 117.57,11.97 ENC1.3
N$6
  Bottom 0.406: ENC0.3 106.77,43.72 100.97,49.53 100.97,68.58 96.52,68.58 RASPBERRRY_PI_3_B+.40
N$7
  Top 0.508: R19.1 R20.2 61.54,67.94 OK3.1
N$8
  Top 0.406: R22.1 OK1.1
N$9
  Top 0.406: R23.1 55.24,64.77 56.2,63.82 65.09,63.82 65.09,68.58 OK1.6
N$10
  Bottom 1.27: OK1.4 60.64,78.11 37.53,78.11 T1.G
N$11
  Bottom 1.27: T1.A1 21.53,71.82
  Bottom 2.54: 21.53,71.82 26.04,67.31 33.9,67.31 DRILL.2
N$12
  pour Top (isolate 0.813): 19.69,53.97 1.27,53.97 1.27,62.86 15.24,62.86 19.69,58.42
N$13  (via drill 0.35)
  Top 0.406: R13.1 73.98,52.07 74.93,53.02 v74.93,53.97 | D2.1 v82.23,35.56
  Bottom 0.406: v74.93,53.97 74.93,42.86 v82.23,35.56
N$14
  Top 0.508: R10.2 38.79,45.14 38.73,45.08 31.75,45.08 K2.I+
N$15  (via drill 0.35)
  Top 0.406: v76.83,56.52 75.88,56.52 73.98,54.61 R14.1 | D3.1 v82.23,39.37
  Bottom 0.406: v76.83,56.52 76.83,44.77 v82.23,39.37
N$16
  Top 0.508: R9.2 37.52,54.03 37.46,53.97 31.75,53.97 K1.I+
N$17
  Top 1.27: 16.43,47.55 K2.4-
  Top 2.54: HEATER3.1 16.43,47.55
  pour Top (isolate 0.305): 20.32,49.53 1.27,49.53 1.27,44.45 20.32,44.45
N$22
  Top 0.508: R13.2 U3.1
N$23
  Top 0.406: R21.1 74.35,69.27 74.93,69.85 79.38,69.85 81.28,71.75 U$1.7
  Top 0.508: R21.1 OK3.4
N$26
  Top 0.508: R19.2 52.22,75.88 B1.+
N$27
  Top 0.406: R22.2 76.15,74.24 77.15,75.25 85.41,75.25 86.36,74.3 U$1.5
N$28
  Top 0.406: RASPBERRRY_PI_3_B+.5 100.01,22.86 102.55,20.32 102.55,19.05 102.55,17.78 118.43,17.78 121.28,17.78 125.05,14.02 I2C.2
N$29  (via drill 0.35)
  Top 0.406: R17.1 80.64,59.74 C1.1 82.87,62.55 v83.82,61.59 U$1.3 | v100.33,15.56 90.8,15.56 v90.8,18.42
  Bottom 0.406: RASPBERRRY_PI_3_B+.7 101.6,25.4 101.6,16.83 v100.33,15.56 | v90.8,18.42 90.8,28.26 86.36,32.7 86.36,59.05 v83.82,61.59
N$30
  Top 0.406: RASPBERRRY_PI_3_B+.3 100.65,20.32 101.28,19.68 101.28,16.83 101.6,16.51 120.33,16.51 123.19,13.65 123.19,11.02 I2C.1
N$33
  Top 0.508: R14.2 U3.3
N$36
  Top 0.508: Q5.4 39.63,57.78 R9.1
N$37
  Top 0.508: Q4.4 R10.1
OUT0
  Top 0.813: HL1.2 14.68,6.43 Q1.4
OUT1
  Top 0.813: HL0.2 29.29,5.79 29.21,5.71 29.21,6.03 Q2.4
OUT1N  (via drill 0.35)
  Top 0.406: U1.7 R3.1 36.41,11.42 v36.4,11.41 | v23.9,3.79 23.87,3.75 Q1.1
  Bottom 0.406: v36.4,11.41 36.4,4.39 35.79,3.79 v23.9,3.79
OUT1N1  (via drill 0.35)
  Top 0.406: U2.7 R7.1 36.41,24.35 v36.2,24.13 | v20.32,32.39 20.32,34.64 Q3.1
  Bottom 0.406: v36.2,24.13 20.32,24.13 v20.32,32.39
OUT1N2
  Top 0.508: U3.7 62.03,53.34 61.63,52.94 61.63,48.76 | 61.63,48.76 60.12,47.25 Q4.1 | 61.63,48.76 63.64,48.76 R5.1
OUT2
  Top 0.813: HL2.2 14.68,36.12 Q3.4 | Q3.4
OUT2N  (via drill 0.35)
  Top 0.406: U1.5 v37.46,17.14 R4.1 | v38.73,3.81 36.05,3.81 Q2.1
  Bottom 0.406: v37.46,17.14 38.73,15.88 v38.73,3.81
OUT2N1
  Top 0.406: Q8.1 36.41,35.17 R8.1 U2.5
OUT2N2
  Top 0.508: R6.1 64,55.94 U3.5 58.39,55.88 Q5.1
OUT3
  Top 0.813: HL3.2 29.29,37.22 Q8.4
PDIR  (via drill 0.35)
  Top 0.406: v104.14,15.24 104.14,13.34 86.36,13.34 v86.36,18.42
  Bottom 0.406: RASPBERRRY_PI_3_B+.15 105.73,35.56 105.73,16.83 v104.14,15.24 | v86.36,18.42 86.36,23.5 84.45,25.4 76.2,25.4 76.11,25.5 PUMP.1
RELAY0
  Top 0.406: RASPBERRRY_PI_3_B+.16 D2.2
RELAY1
  Top 0.406: RASPBERRRY_PI_3_B+.18 90.02,38.1 D3.2
SCLK  (via drill 0.35)
  Top 0.406: RASPBERRRY_PI_3_B+.23 v120.65,45.72 127,45.72 v133.35,39.37
  Bottom 0.406: v120.65,45.72 IC2.13 | v133.35,39.37 IC1.13
SDIR  (via drill 0.35)
  Top 0.406: RASPBERRRY_PI_3_B+.35 v102.23,60.96 | v102.23,69.85 90.8,69.85 v89.53,68.58 | v89.53,45.4 85.41,45.4 73.66,33.66 73.66,31.75 69.22,27.31 63.5,27.31 63.48,27.32 P2.4
  Bottom 0.406: v102.23,60.96 v102.23,69.85 | v89.53,68.58 v89.53,45.4
SPEED
  Top 0.406: PUMP.2 78.11,28.66 79.46,27.31 93.34,27.31 RASPBERRRY_PI_3_B+.12
STP
  Top 0.406: RASPBERRRY_PI_3_B+.36 68.48,32.92 P2.6
THERM0
  Bottom 0.406: IC1.1 148.59,31.75 148.59,20 152.4,20 152.4,12.79 THERM0.3
THERM1
  Bottom 0.406: IC1.2 150.5,34.29 150.5,21.68 THERM1.3
THERM2
  Bottom 0.406: IC1.3 151.77,36.83 151.77,30.48 156.12,30.48 THERM2.3
THERM3
  Bottom 0.406: IC1.4 156.12,39.37 THERM3.3
TIM
  Top 0.406: RASPBERRRY_PI_3_B+.38 66.04,33.02 59.75,33.02 58.48,31.75 P2.2
(copper drawn outside any net)
  shapes: Top area x2

### Text on the board
tPlace: Carnegie Mellon University | Autonomous Prospecting & | Extraction System | Single Board Controller V1.0 | -Ismael Mercier